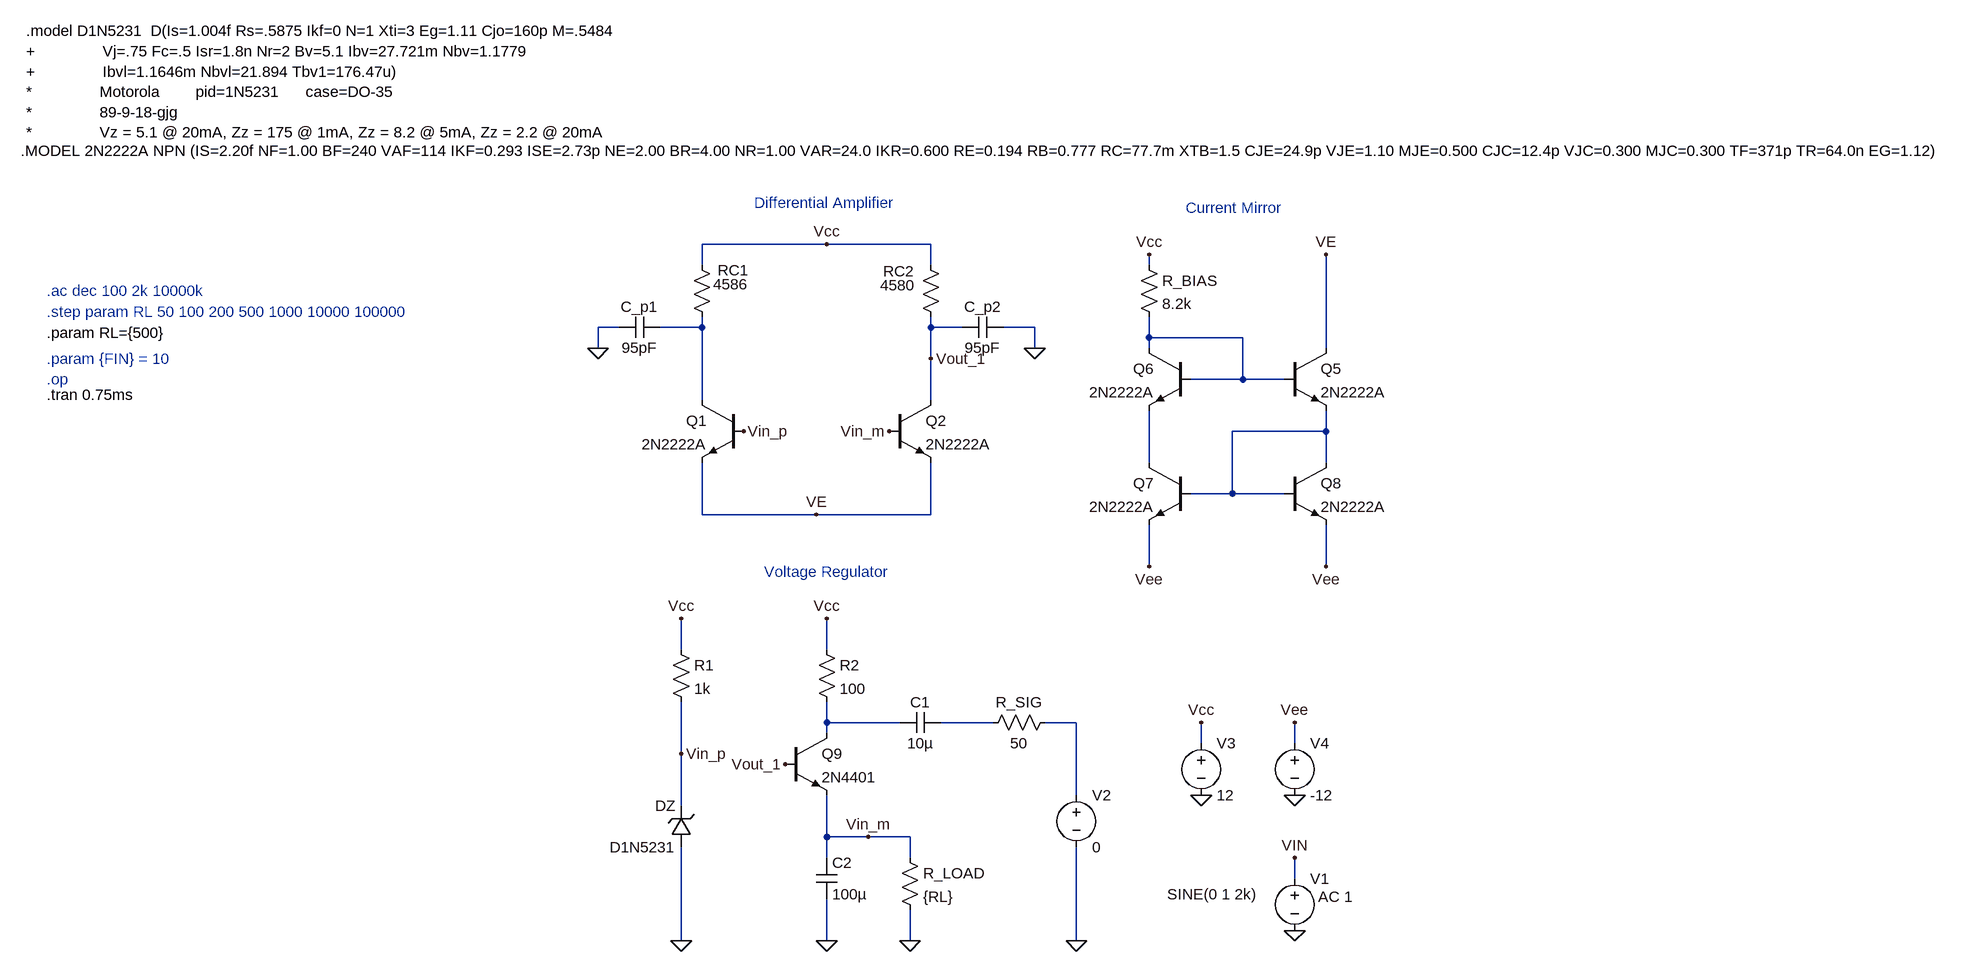
[diagram p0: schematic Diffamp 3b Voltage Regulator.asc]
Diffamp 3b Voltage Regulator.asc, the LTspice schematic file:
Version 4
SHEET 1 3976 1688
WIRE 1216 48 1024 48
WIRE 1376 48 1216 48
WIRE 1024 80 1024 48
WIRE 1376 80 1376 48
WIRE 1712 80 1712 64
WIRE 896 176 864 176
WIRE 1024 176 1024 160
WIRE 1024 176 960 176
WIRE 1376 176 1376 160
WIRE 1424 176 1376 176
WIRE 1536 176 1488 176
WIRE 1712 192 1712 160
WIRE 1856 192 1712 192
WIRE 864 208 864 176
WIRE 1536 208 1536 176
WIRE 1712 208 1712 192
WIRE 1984 208 1984 64
WIRE 1376 224 1376 176
WIRE 1856 256 1856 192
WIRE 1856 256 1776 256
WIRE 1920 256 1856 256
WIRE 1024 288 1024 176
WIRE 1376 288 1376 224
WIRE 1984 336 1984 304
WIRE 1984 336 1840 336
WIRE 1712 384 1712 304
WIRE 1984 384 1984 336
WIRE 1840 432 1840 336
WIRE 1840 432 1776 432
WIRE 1920 432 1840 432
WIRE 1024 464 1024 384
WIRE 1200 464 1024 464
WIRE 1376 464 1376 384
WIRE 1376 464 1200 464
WIRE 1712 544 1712 480
WIRE 1984 544 1984 480
WIRE 992 672 992 624
WIRE 1216 672 1216 624
WIRE 1216 784 1216 752
WIRE 1328 784 1216 784
WIRE 1472 784 1392 784
WIRE 1600 784 1552 784
WIRE 1216 800 1216 784
WIRE 1792 816 1792 784
WIRE 1936 816 1936 784
WIRE 992 832 992 752
WIRE 1600 896 1600 784
WIRE 992 912 992 832
WIRE 1216 960 1216 896
WIRE 1280 960 1216 960
WIRE 1344 960 1280 960
WIRE 1216 992 1216 960
WIRE 1344 992 1344 960
WIRE 1936 1024 1936 992
WIRE 992 1120 992 976
WIRE 1216 1120 1216 1056
WIRE 1344 1120 1344 1072
WIRE 1600 1120 1600 976
FLAG 1792 896 0
FLAG 1792 784 Vcc
FLAG 1216 48 Vcc
FLAG 1936 896 0
FLAG 1936 784 Vee
FLAG 1936 1104 0
FLAG 1936 992 VIN
FLAG 1712 64 Vcc
FLAG 1984 544 Vee
FLAG 1712 544 Vee
FLAG 1200 464 VE
FLAG 1984 64 VE
FLAG 1536 208 0
FLAG 864 208 0
FLAG 1088 336 Vin_p
FLAG 1312 336 Vin_m
FLAG 1376 224 Vout_1
FLAG 1216 624 Vcc
FLAG 1344 1120 0
FLAG 1216 1120 0
FLAG 992 1120 0
FLAG 992 624 Vcc
FLAG 1600 1120 0
FLAG 992 832 Vin_p
FLAG 1152 848 Vout_1
FLAG 1280 960 Vin_m
SYMBOL voltage 1792 800 R0
SYMATTR InstName V3
SYMATTR Value 12
SYMBOL npn 1088 288 M0
SYMATTR InstName Q1
SYMATTR Value 2N2222A
SYMBOL npn 1312 288 R0
SYMATTR InstName Q2
SYMATTR Value 2N2222A
SYMBOL res 1008 64 R0
WINDOW 0 40 24 Left 2
WINDOW 3 33 46 Left 2
SYMATTR InstName RC1
SYMATTR Value 4586
SYMATTR SpiceLine tol=5
SYMBOL res 1360 64 R0
WINDOW 0 -57 26 Left 2
WINDOW 3 -62 47 Left 2
SYMATTR InstName RC2
SYMATTR Value 4580
SYMATTR SpiceLine tol=5
SYMBOL voltage 1936 800 R0
SYMATTR InstName V4
SYMATTR Value -12
SYMBOL voltage 1936 1008 R0
WINDOW 3 -196 40 Left 2
WINDOW 123 36 44 Left 2
WINDOW 39 0 0 Left 0
SYMATTR Value SINE(0 1 2k)
SYMATTR Value2 AC 1
SYMATTR InstName V1
SYMBOL npn 1920 208 R0
SYMATTR InstName Q5
SYMATTR Value 2N2222A
SYMBOL npn 1776 208 M0
SYMATTR InstName Q6
SYMATTR Value 2N2222A
SYMBOL npn 1776 384 M0
SYMATTR InstName Q7
SYMATTR Value 2N2222A
SYMBOL npn 1920 384 R0
SYMATTR InstName Q8
SYMATTR Value 2N2222A
SYMBOL res 1696 64 R0
SYMATTR InstName R_BIAS
SYMATTR Value 8.2k
SYMATTR SpiceLine tol=5
SYMBOL cap 960 160 R90
WINDOW 0 0 32 VBottom 2
WINDOW 3 32 32 VTop 2
SYMATTR InstName C_p1
SYMATTR Value 95pF
SYMBOL cap 1424 192 R270
WINDOW 0 32 32 VTop 2
WINDOW 3 0 32 VBottom 2
SYMATTR InstName C_p2
SYMATTR Value 95pF
SYMBOL npn 1152 800 R0
SYMATTR InstName Q9
SYMATTR Value 2N4401
SYMBOL res 1200 656 R0
SYMATTR InstName R2
SYMATTR Value 100
SYMBOL cap 1392 768 R90
WINDOW 0 0 32 VBottom 2
WINDOW 3 32 32 VTop 2
SYMATTR InstName C1
SYMATTR Value 10µ
SYMBOL res 1568 768 R90
WINDOW 0 0 56 VBottom 2
WINDOW 3 32 56 VTop 2
SYMATTR InstName R_SIG
SYMATTR Value 50
SYMBOL voltage 1600 880 R0
WINDOW 123 0 0 Left 0
WINDOW 39 0 0 Left 0
SYMATTR InstName V2
SYMATTR Value 0
SYMBOL cap 1200 992 R0
SYMATTR InstName C2
SYMATTR Value 100µ
SYMBOL res 1328 976 R0
SYMATTR InstName R_LOAD
SYMATTR Value {RL}
SYMBOL res 976 656 R0
SYMATTR InstName R1
SYMATTR Value 1k
SYMBOL zener 1008 976 R180
WINDOW 0 24 64 Left 2
WINDOW 3 24 0 Left 2
SYMATTR InstName DZ
SYMATTR Value D1N5231
TEXT -24 -96 Left 2 !.MODEL 2N2222A NPN (IS=2.20f NF=1.00 BF=240 VAF=114 IKF=0.293 ISE=2.73p NE=2.00 BR=4.00 NR=1.00 VAR=24.0 IKR=0.600 RE=0.194 RB=0.777 RC=77.7m XTB=1.5 CJE=24.9p VJE=1.10 MJE=0.500 CJC=12.4p VJC=0.300 MJC=0.300 TF=371p TR=64.0n EG=1.12)
TEXT 16 120 Left 2 ;.ac dec 100 2k 10000k
TEXT 16 152 Left 2 ;.step param RL 50 100 200 500 1000 10000 100000
TEXT 16 184 Left 2 !.param RL={500}
TEXT 16 224 Left 2 ;.param {FIN} = 10
TEXT 16 256 Left 2 ;.op
TEXT 16 280 Left 2 !.tran 0.75ms
TEXT 1104 -16 Left 2 ;Differential Amplifier
TEXT 1768 -8 Left 2 ;Current Mirror
TEXT 1120 552 Left 2 ;Voltage Regulator
TEXT -16 -280 Left 2 !.model D1N5231  D(Is=1.004f Rs=.5875 Ikf=0 N=1 Xti=3 Eg=1.11 Cjo=160p M=.5484\n+               Vj=.75 Fc=.5 Isr=1.8n Nr=2 Bv=5.1 Ibv=27.721m Nbv=1.1779\n+               Ibvl=1.1646m Nbvl=21.894 Tbv1=176.47u)\n*               Motorola        pid=1N5231      case=DO-35\n*               89-9-18-gjg\n*               Vz = 5.1 @ 20mA, Zz = 175 @ 1mA, Zz = 8.2 @ 5mA, Zz = 2.2 @ 20mA

The netlist it stands for:
* Diffamp 3b Voltage Regulator.asc
V3 Vcc 0 12
Q1 N001 Vin_p VE 0 2N2222A
Q2 Vout_1 Vin_m VE 0 2N2222A
RC1 Vcc N001 4586 tol=5
RC2 Vcc Vout_1 4580 tol=5
V4 Vee 0 -12
V1 VIN 0 SINE(0 1 2k) AC 1
Q5 VE N002 N003 0 2N2222A
Q6 N002 N002 N004 0 2N2222A
Q7 N004 N003 Vee 0 2N2222A
Q8 N003 N003 Vee 0 2N2222A
R_BIAS Vcc N002 8.2k tol=5
C_p1 N001 0 95pF
C_p2 Vout_1 0 95pF
Q9 N005 Vout_1 Vin_m 0 2N4401
R2 Vcc N005 100
C1 N006 N005 10µ
R_SIG N007 N006 50
V2 N007 0 0
C2 Vin_m 0 100µ
R_LOAD Vin_m 0 {RL}
R1 Vcc Vin_p 1k
DZ 0 Vin_p D1N5231
.model D D
.lib standard.dio
.model NPN NPN
.model PNP PNP
.lib standard.bjt
.MODEL 2N2222A NPN (IS=2.20f NF=1.00 BF=240 VAF=114 IKF=0.293 ISE=2.73p NE=2.00 BR=4.00 NR=1.00 VAR=24.0 IKR=0.600 RE=0.194 RB=0.777 RC=77.7m XTB=1.5 CJE=24.9p VJE=1.10 MJE=0.500 CJC=12.4p VJC=0.300 MJC=0.300 TF=371p TR=64.0n EG=1.12)
* .ac dec 100 2k 10000k
* .step param RL 50 100 200 500 1000 10000 100000
.param RL={500}
* .param {FIN} = 10
* .op
.tran 0.75ms
* Differential Amplifier
* Current Mirror
* Voltage Regulator
.model D1N5231  D(Is=1.004f Rs=.5875 Ikf=0 N=1 Xti=3 Eg=1.11 Cjo=160p M=.5484
+               Vj=.75 Fc=.5 Isr=1.8n Nr=2 Bv=5.1 Ibv=27.721m Nbv=1.1779
+               Ibvl=1.1646m Nbvl=21.894 Tbv1=176.47u)
*               Motorola        pid=1N5231      case=DO-35
*               89-9-18-gjg
*               Vz = 5.1 @ 20mA, Zz = 175 @ 1mA, Zz = 8.2 @ 5mA, Zz = 2.2 @ 20mA
.backanno
.end